# EAGLE board Xpander6-VIC (EAGLE 7.7.0)
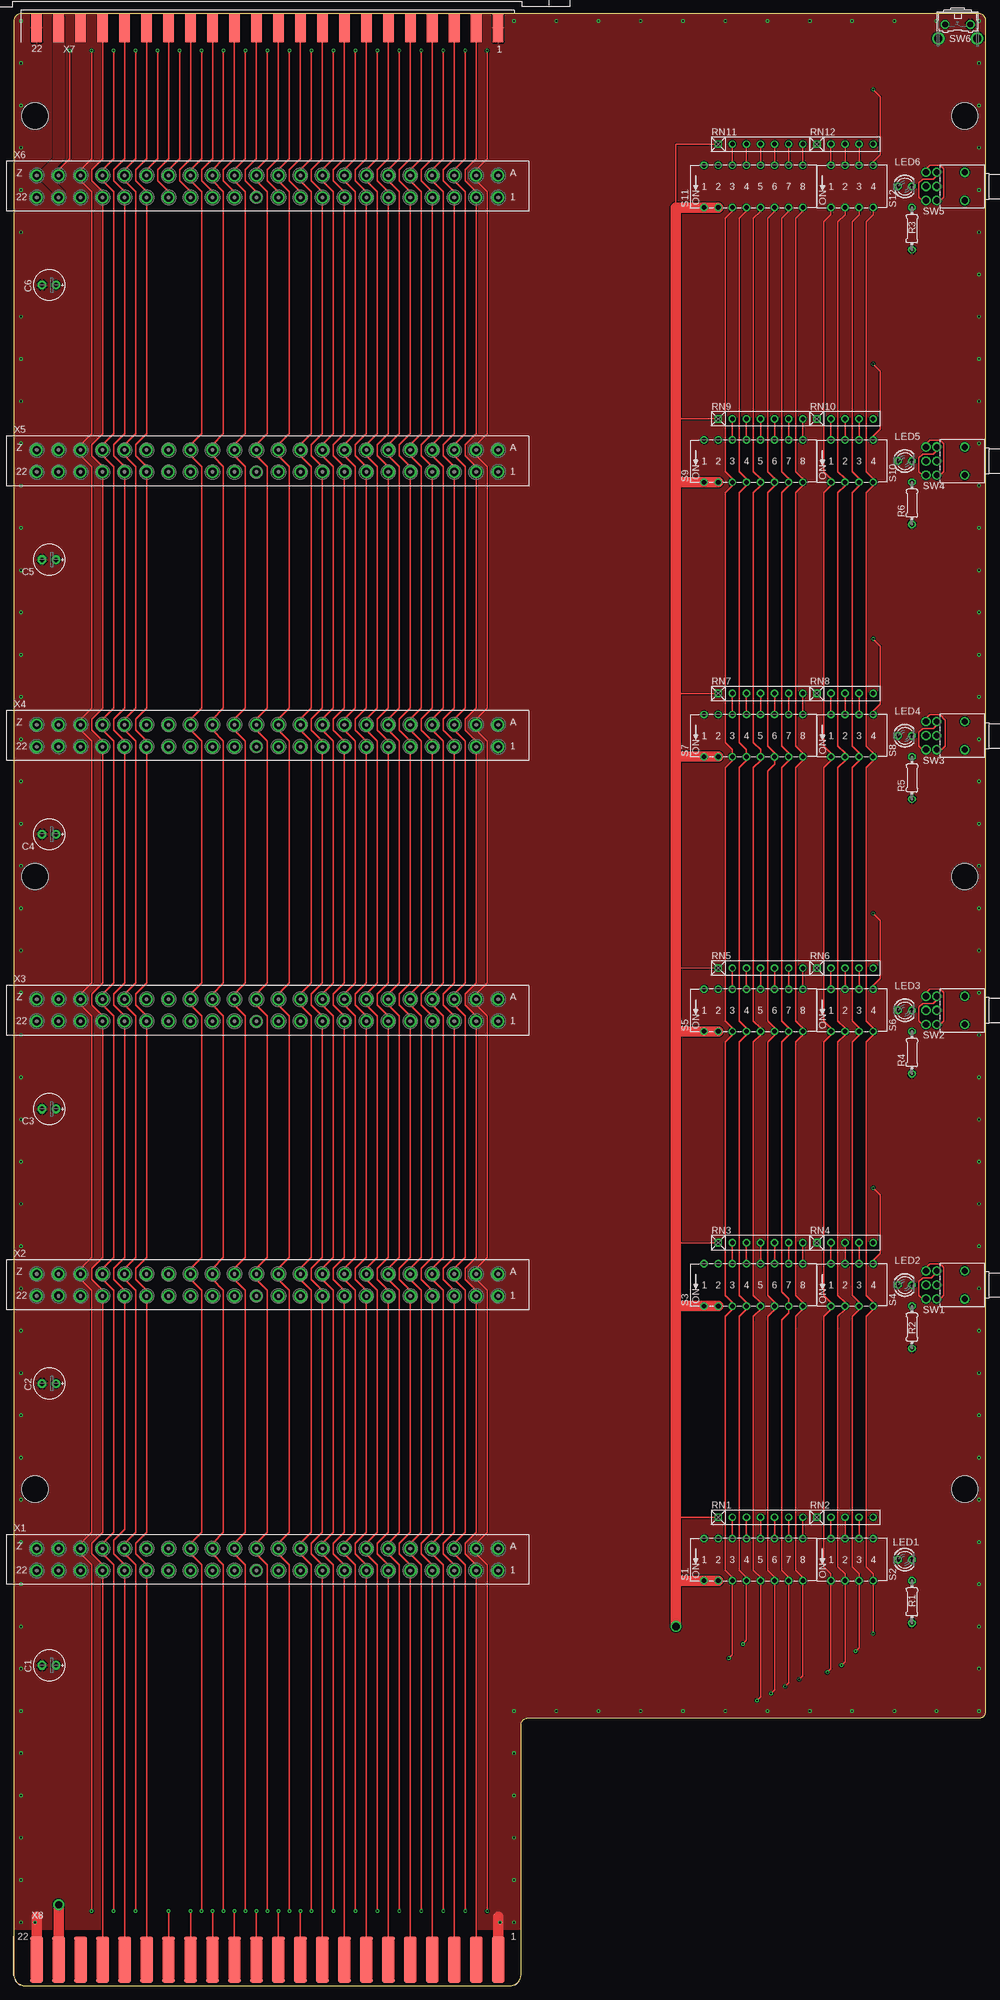
[diagram p5: board, top side]
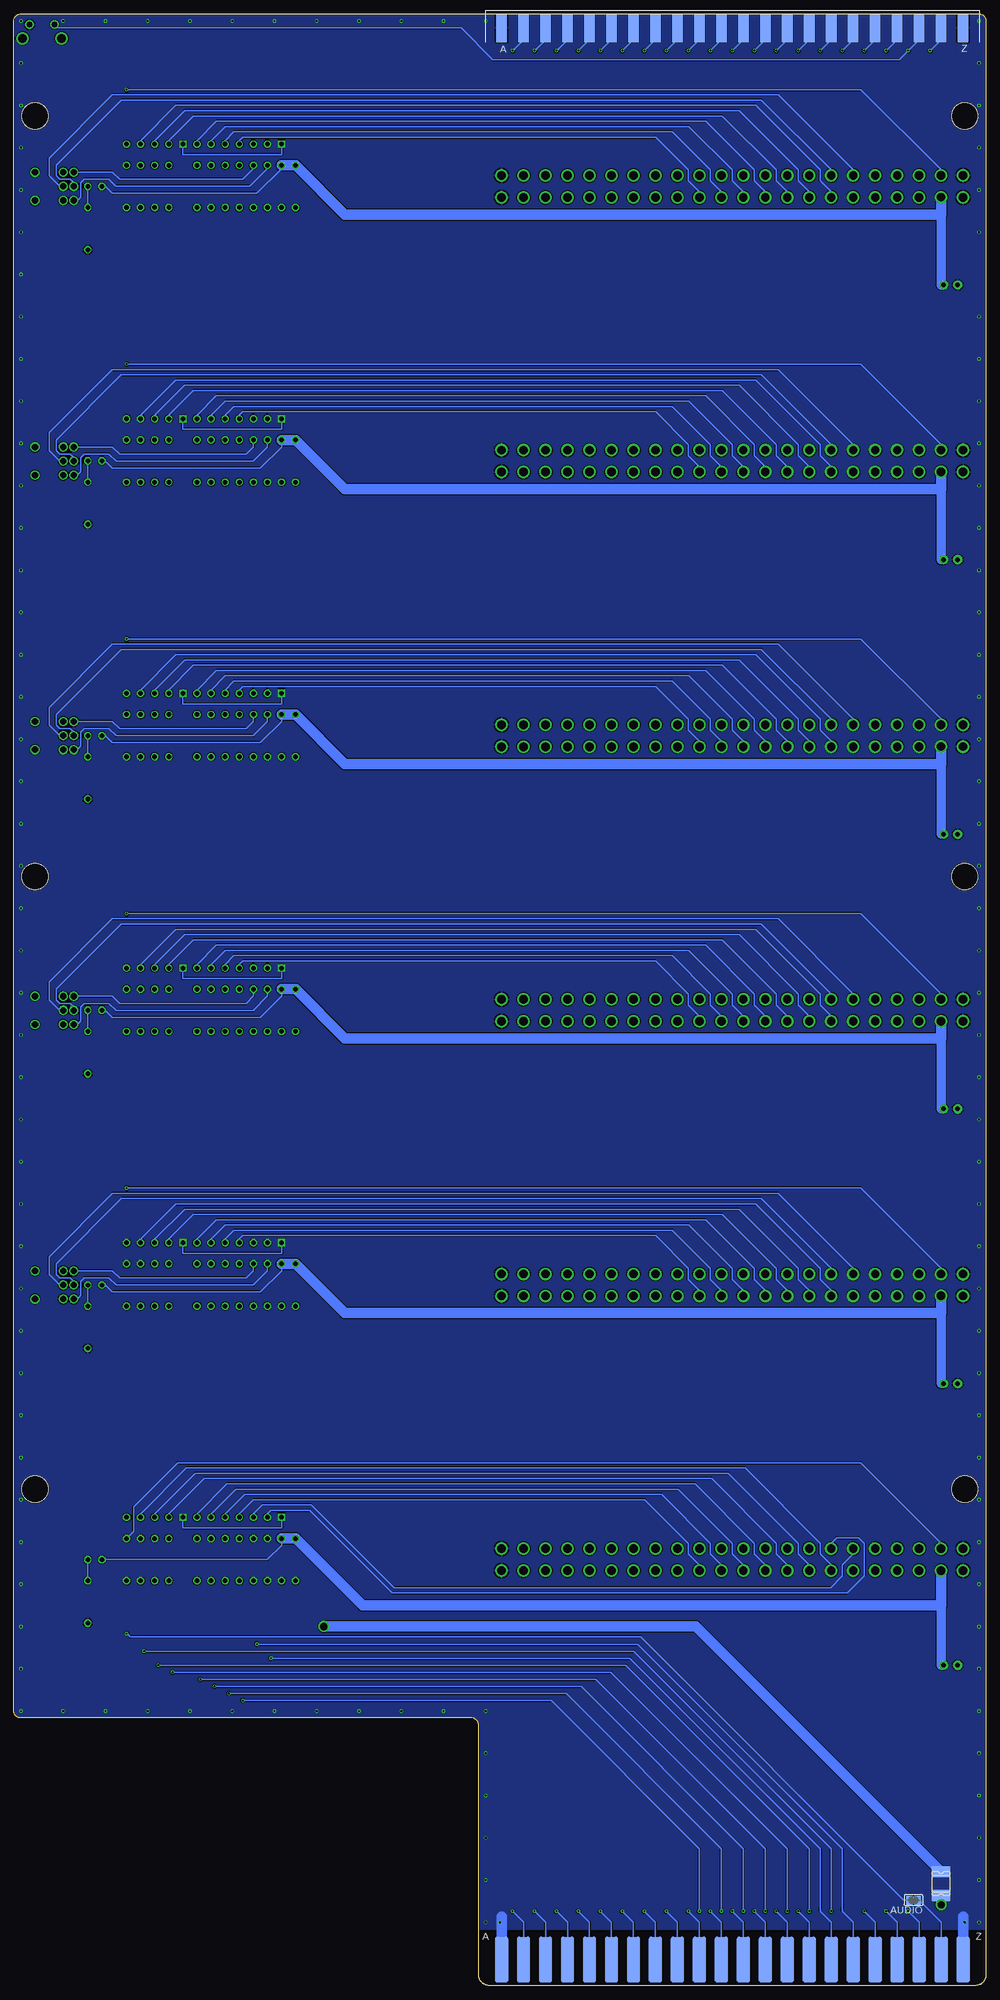
[diagram p6: board, bottom side, seen from below]

Size 175.26 x 355.6 mm. Coordinates in mm from the lower left corner, seen from the top.
Outline: 2,0 89.44,0 arc90 91.44,2 91.44,46.99 arc-90 92.71,48.26 173.99,48.26 arc90 175.26,49.53 175.26,354.33 arc90 173.99,355.6 1.27,355.6 arc90 0,354.33 0,2 arc90 2,0
Copper layers (1*16): Top 0.035mm / dielectric 1.5mm / Bottom 0.035mm
Design rules "hackvana *": minimum track width 6mil, minimum drill 0.3mm, track to track 6mil, track to pad 6mil, pad to pad 6mil, via to via 6mil, smd to smd 0mil, copper to edge 6mil, drill to drill 6mil, minimum pad ring 10mil, minimum via ring 6mil, stop-mask expansion 2mil, vias tented up to drill 100mil, thermal gap 10mil
Holes 4.75 mm at 171.45,89.53 171.45,337.19 3.81,337.19 3.81,89.53 3.81,200.02 171.45,200.02

## Footprints (pad centres in the part's own frame; a part is rotated, then mirrored left to right if it is on the bottom)
SJ = smd 1.168 x 1.6: 1 -0.762,0; 2 0.762,0
E2,5-6E = drill 0.813 pad 1.575: + -1.27,0 | drill 0.813 pad 1.575 octagon: - 1.27,0
1812L = smd 2.03 x 3.3: P$1 -2.16,0; P$2 2.16,0
LED3MM = drill 0.813 octagon: A -1.27,0; K 1.27,0
0204/7 = drill 0.813 octagon: 1 -3.81,0; 2 3.81,0
RN-7 = drill 0.813 square: 1 -7.62,0 | drill 0.813: 2 -5.08,0; 3 -2.54,0; 4 0,0; 5 2.54,0; 6 5.08,0; 7 7.62,0
RN-5 = drill 0.813 square: 1 -5.08,0 | drill 0.813: 2 -2.54,0; 3 0,0; 4 2.54,0; 5 5.08,0
DIP08SB = drill 0.813: 1 -8.89,-3.81; 2 -6.35,-3.81; 3 -3.81,-3.81; 4 -1.27,-3.81; 5 1.27,-3.81; 6 3.81,-3.81; 7 6.35,-3.81; 8 8.89,-3.81; 9 8.89,3.81; 10 6.35,3.81; 11 3.81,3.81; 12 1.27,3.81; 13 -1.27,3.81; 14 -3.81,3.81; 15 -6.35,3.81; 16 -8.89,3.81
DIP04SB = drill 0.813: 1 -3.81,-3.81; 2 -1.27,-3.81; 3 1.27,-3.81; 4 3.81,-3.81; 5 3.81,3.81; 6 1.27,3.81; 7 -1.27,3.81; 8 -3.81,3.81
TL4XWO = drill 1.1 pad 1.422: 1 -2.54,-5.08; 2 0,-5.08; 3 2.54,-5.08; 4 -2.54,-6.985; 5 0,-6.985; 6 2.54,-6.985 | drill 1.1 pad 1.676: M1 -2.54,0; M2 2.54,0
B3F-31XX = drill 1.016 octagon: 1 -2.261,-1.245; 2 2.261,-1.245 | drill 1.499 pad 2.159: 3 -3.505,1.245; 4 3.505,1.245
FE156-22-2 = drill 1.5: 1 41.605,-1.981; 2 37.643,-1.981; 3 33.68,-1.981; 4 29.718,-1.981; 5 25.756,-1.981; 6 21.793,-1.981; 7 17.831,-1.981; 8 13.868,-1.981; 9 9.906,-1.981; 10 5.944,-1.981; 11 1.981,-1.981; 12 -1.981,-1.981; 13 -5.944,-1.981; 14 -9.906,-1.981; 15 -13.868,-1.981; 16 -17.831,-1.981; 17 -21.793,-1.981; 18 -25.756,-1.981; 19 -29.718,-1.981; 20 -33.68,-1.981; 21 -37.644,-1.958; 22 -41.605,-1.98; A 41.605,1.981; B 37.643,1.981; C 33.68,1.981; D 29.718,1.981; E 25.756,1.981; F 21.793,1.981; H 17.831,1.981; J 13.868,1.981; K 9.906,1.981; L 5.944,1.981; M 1.981,1.981; N -1.981,1.981; P -5.944,1.981; R -9.906,1.981; S -13.868,1.981; T -17.831,1.981; U -21.793,1.981; V -25.756,1.981; W -29.718,1.981; X -33.68,1.981; Y -37.643,1.981; Z -41.605,1.981
MA156-22-2SHORT = smd 1.905 x 5.08: 1 41.605,0; 2 37.643,0; 3 33.68,0; 4 29.718,0; 5 25.756,0; 6 21.793,0; 7 17.831,0; 8 13.868,0; 9 9.906,0; 10 5.944,0; 11 1.981,0; 12 -1.981,0; 13 -5.944,0; 14 -9.906,0; 15 -13.868,0; 16 -17.831,0; 17 -21.793,0; 18 -25.756,0; 19 -29.718,0; 20 -33.68,0; 21 -37.643,0; 22 -41.605,0 | smd 1.905 x 5.08 bottom: A 41.605,0; B 37.643,0; C 33.68,0; D 29.718,0; E 25.756,0; F 21.793,0; H 17.831,0; J 13.868,0; K 9.906,0; L 5.944,0; M 1.981,0; N -1.981,0; P -5.944,0; R -9.906,0; S -13.868,0; T -17.831,0; U -21.793,0; V -25.756,0; W -29.718,0; X -33.68,0; Y -37.643,0; Z -41.605,0
MA156-22-2 = smd 2.286 x 8.255: 1 41.605,-0.381; 2 37.643,-0.381; 3 33.68,-0.381; 4 29.718,-0.381; 5 25.756,-0.381; 6 21.793,-0.381; 7 17.831,-0.381; 8 13.868,-0.381; 9 9.906,-0.381; 10 5.944,-0.381; 11 1.981,-0.381; 12 -1.981,-0.381; 13 -5.944,-0.381; 14 -9.906,-0.381; 15 -13.868,-0.381; 16 -17.831,-0.381; 17 -21.793,-0.381; 18 -25.756,-0.381; 19 -29.718,-0.381; 20 -33.68,-0.381; 21 -37.643,-0.381; 22 -41.605,-0.381 | smd 2.286 x 8.255 bottom: A 41.605,-0.381; B 37.643,-0.381; C 33.68,-0.381; D 29.718,-0.381; E 25.756,-0.381; F 21.793,-0.381; H 17.831,-0.381; J 13.868,-0.381; K 9.906,-0.381; L 5.944,-0.381; M 1.981,-0.381; N -1.981,-0.381; P -5.944,-0.381; R -9.906,-0.381; S -13.868,-0.381; T -17.831,-0.381; U -21.793,-0.381; V -25.756,-0.381; W -29.718,-0.381; X -33.68,-0.381; Y -37.643,-0.381; Z -41.605,-0.381

## Placement (x,y rotation side)
AUDIO  [SJ]  13.06,15.42 180 bottom
C1  47uF  [E2,5-6E]  6.35,57.78 180 top
C2  47uF  [E2,5-6E]  6.35,108.58 180 top
C3  47uF  [E2,5-6E]  6.35,158.12 180 top
C4  47uF  [E2,5-6E]  6.35,207.64 180 top
C5  47uF  [E2,5-6E]  6.35,257.18 180 top
C6  47uF  [E2,5-6E]  6.35,306.7 180 top
F1  1812L  [1812L]  8.08,18.39 90 bottom
LED1  [LED3MM]  160.66,76.83 0 top
LED2  [LED3MM]  160.66,126.36 0 top
LED3  [LED3MM]  160.66,175.89 0 top
LED4  [LED3MM]  160.66,225.43 0 top
LED5  [LED3MM]  160.66,274.95 0 top
LED6  [LED3MM]  160.66,324.49 0 top
R1  330  [0204/7]  161.93,69.21 90 top
R2  330  [0204/7]  161.93,118.74 90 top
R3  330  [0204/7]  161.93,316.87 90 top
R4  330  [0204/7]  161.93,168.27 90 top
R5  330  [0204/7]  161.93,217.81 90 top
R6  330  [0204/7]  161.93,267.33 90 top
RN1  [RN-7]  134.62,84.45 0 top
RN2  [RN-5]  149.86,84.45 0 top
RN3  [RN-7]  134.62,133.98 0 top
RN4  [RN-5]  149.86,133.98 0 top
RN5  [RN-7]  134.62,183.51 0 top
RN6  [RN-5]  149.86,183.51 0 top
RN7  [RN-7]  134.62,233.05 0 top
RN8  [RN-5]  149.86,233.05 0 top
RN9  [RN-7]  134.62,282.57 0 top
RN10  [RN-5]  149.86,282.57 0 top
RN11  [RN-7]  134.62,332.11 0 top
RN12  [RN-5]  149.86,332.11 0 top
S1  [DIP08SB]  133.35,76.83 0 top
S2  [DIP04SB]  151.13,76.83 0 top
S3  [DIP08SB]  133.35,126.36 0 top
S4  [DIP04SB]  151.13,126.36 0 top
S5  [DIP08SB]  133.35,175.89 0 top
S6  [DIP04SB]  151.13,175.89 0 top
S7  [DIP08SB]  133.35,225.43 0 top
S8  [DIP04SB]  151.13,225.43 0 top
S9  [DIP08SB]  133.35,274.95 0 top
S10  [DIP04SB]  151.13,274.95 0 top
S11  [DIP08SB]  133.35,324.49 0 top
S12  [DIP04SB]  151.13,324.49 0 top
SW1  TL46WO  [TL4XWO]  171.45,126.36 270 top
SW2  TL46WO  [TL4XWO]  171.45,175.89 270 top
SW3  TL46WO  [TL4XWO]  171.45,225.43 270 top
SW4  TL46WO  [TL4XWO]  171.45,274.95 270 top
SW5  TL46WO  [TL4XWO]  171.45,324.49 270 top
SW6  !RESET  [B3F-31XX]  170.18,352.42 180 top
X1  PORT_EXPANSION_VIC_CONN  [FE156-22-2]  45.72,76.83 0 top
X2  PORT_EXPANSION_VIC_CONN  [FE156-22-2]  45.72,126.36 0 top
X3  PORT_EXPANSION_VIC_CONN  [FE156-22-2]  45.72,175.89 0 top
X4  PORT_EXPANSION_VIC_CONN  [FE156-22-2]  45.72,225.43 0 top
X5  PORT_EXPANSION_VIC_CONN  [FE156-22-2]  45.72,274.95 0 top
X6  PORT_EXPANSION_VIC_CONN  [FE156-22-2]  45.72,324.49 0 top
X7  PORT_EXPANSION_VIC_CONNR  [MA156-22-2SHORT]  45.72,353.06 0 top
X8  PORT_EXPANSION_VIC_EDGE  [MA156-22-2]  45.72,5.08 0 top

## Tracks (layer width: path | path; a pad name or v marks a point on that pad's centre or on a via)
!BLK1  (via drill 0.3)
  Top 0.254: v133.99,51.43 134.62,52.07 S1.5 | 134.62,73.66 133.35,74.93 133.35,119.95 | X8.10 v51.66,13.44 | S9.5 134.62,271.78 133.35,273.05 133.35,318.77 134.62,320.04 S11.5 | 134.62,270.89 S9.5 | 133.35,119.95 133.35,120.65 134.62,121.92 S3.5 134.62,123.19 133.35,124.46 133.35,170.18 134.62,171.45 S5.5 134.62,172.72 133.35,173.99 133.35,219.71 134.62,220.98 S7.5 134.62,222.88 133.35,224.15 133.35,269.24 134.62,270.51 S9.5 | 133.35,119.95 | S11.5 | 134.62,73.66 | 134.62,73.66 S1.5 | S1.5
  Bottom 0.254: v133.99,51.43 78.38,51.43 51.66,24.71 v51.66,13.44
!BLK1_1
  Top 0.254: RN1.4 S1.12
  Bottom 0.254: X1.10 51.66,75.84 53.64,77.83 53.64,79.81 61.47,87.63 132.08,87.63 134.62,85.09 RN1.4
!BLK1_2
  Top 0.254: RN3.4 S3.12
  Bottom 0.254: X2.10 51.66,125.37 53.64,127.36 53.64,129.34 59.56,135.25 133.99,135.25 134.62,134.62 RN3.4
!BLK1_3
  Top 0.254: RN5.4 S5.12
  Bottom 0.254: X3.10 51.66,174.9 53.64,176.89 53.64,178.87 59.56,184.78 133.99,184.78 134.62,184.15 RN5.4
!BLK1_4
  Top 0.254: RN7.4 S7.12
  Bottom 0.254: X4.10 51.66,224.43 53.64,226.42 53.64,228.4 59.56,234.31 133.99,234.31 134.62,233.68 RN7.4
!BLK1_5
  Top 0.254: S9.12 | RN9.4 S9.12
  Bottom 0.254: X5.10 51.66,273.96 53.64,275.95 53.64,277.93 59.56,283.84 133.99,283.84 134.62,283.21 RN9.4
!BLK1_6
  Top 0.254: X6.10 51.66,323.49 49.68,325.48 49.68,327.46 51.66,329.44 X7.10 | RN11.4 S11.12
  Bottom 0.254: X6.10 51.66,323.49 53.64,325.48 53.64,327.46 59.56,333.38 133.99,333.38 134.62,332.74 | 134.62,332.74 | 134.62,332.74 | 134.62,332.74 RN11.4
!BLK2  (via drill 0.3)
  Top 0.254: v136.53,52.7 137.16,53.34 S1.6 | 137.16,73.66 135.89,74.93 135.89,118.74 | 135.89,118.74 135.89,119.95 | X8.11 v47.7,13.44 | S9.6 137.16,271.78 135.89,273.05 135.89,318.77 137.16,320.04 S11.6 | 137.16,270.89 S9.6 | 135.89,118.74 135.89,120.65 137.16,121.92 S3.6 137.16,123.19 135.89,124.46 135.89,170.18 137.16,171.45 S5.6 137.16,172.72 135.89,173.99 135.89,219.07 137.16,220.34 S7.6 137.16,222.25 135.89,223.52 135.89,269.24 137.16,270.51 S9.6 | 135.89,118.74 | S11.6 | 137.16,73.66 | 137.16,73.66 S1.6 | S1.6
  Bottom 0.254: v136.53,52.7 75.69,52.7 47.7,24.71 v47.7,13.44
!BLK2_1
  Top 0.254: RN1.5 S1.11
  Bottom 0.254: X1.11 47.7,75.84 49.68,77.83 49.68,79.81 58.46,88.58 133.67,88.58 137.16,85.09 RN1.5
!BLK2_2
  Top 0.254: RN3.5 S3.11
  Bottom 0.254: X2.11 47.7,125.37 49.68,127.36 49.68,129.34 56.55,136.21 135.57,136.21 137.16,134.62 RN3.5
!BLK2_3
  Top 0.254: RN5.5 S5.11
  Bottom 0.254: X3.11 47.7,174.9 49.68,176.89 49.68,178.87 56.55,185.74 135.57,185.74 137.16,184.15 RN5.5
!BLK2_4
  Top 0.254: RN7.5 S7.11
  Bottom 0.254: X4.11 47.7,224.43 49.68,226.42 49.68,228.4 56.55,235.27 135.57,235.27 137.16,233.68 RN7.5
!BLK2_5
  Top 0.254: RN9.5 S9.11
  Bottom 0.254: X5.11 47.7,273.96 49.68,275.95 49.68,277.93 56.55,284.8 135.57,284.8 137.16,283.21 RN9.5 137.16,282.32
!BLK2_6
  Top 0.254: X6.11 47.7,323.49 45.72,325.48 45.72,327.46 47.7,329.44 X7.11 | RN11.5 S11.11
  Bottom 0.254: X6.11 47.7,323.49 49.68,325.48 49.68,327.46 56.55,334.33 135.57,334.33 137.16,332.74 | 137.16,332.74 | 137.16,332.74 RN11.5
!BLK3  (via drill 0.3)
  Top 0.254: v139.06,53.97 139.7,54.61 S1.7 | 139.7,73.66 138.43,74.93 138.43,118.74 | 138.43,118.74 138.43,119.95 | X8.12 v43.74,13.44 | S9.7 139.7,271.78 138.43,273.05 138.43,318.77 139.7,320.04 S11.7 | 139.7,270.89 S9.7 | 138.43,118.74 138.43,120.01 139.7,121.28 S3.7 139.7,123.82 138.43,125.09 138.43,170.18 139.7,171.45 S5.7 139.7,172.72 138.43,173.99 138.43,219.71 139.7,220.98 S7.7 139.7,222.25 138.43,223.52 138.43,269.24 139.7,270.51 S9.7 | 138.43,118.74 | S11.7 | 139.7,73.66 | 139.7,73.66 S1.7 | S1.7
  Bottom 0.254: v139.06,53.97 73,53.97 43.74,24.71 v43.74,13.44
!BLK3_1
  Top 0.254: RN1.6 S1.10
  Bottom 0.254: X1.12 43.74,75.84 45.72,77.83 45.72,79.81 55.45,89.53 135.25,89.53 139.7,85.09 RN1.6
!BLK3_2
  Top 0.254: RN3.6 S3.10
  Bottom 0.254: X2.12 43.74,125.37 45.72,127.36 45.72,129.34 53.54,137.16 137.16,137.16 139.7,134.62 RN3.6
!BLK3_3
  Top 0.254: RN5.6 S5.10
  Bottom 0.254: X3.12 43.74,174.9 45.72,176.89 45.72,178.87 53.54,186.69 137.16,186.69 139.7,184.15 RN5.6
!BLK3_4
  Top 0.254: RN7.6 S7.10
  Bottom 0.254: X4.12 43.74,224.43 45.72,226.42 45.72,228.4 53.54,236.22 137.16,236.22 139.7,233.68 RN7.6
!BLK3_5
  Top 0.254: RN9.6 S9.10
  Bottom 0.254: X5.12 43.74,273.96 45.72,275.95 45.72,277.93 53.54,285.75 137.16,285.75 139.7,283.21 RN9.6 139.7,282.32
!BLK3_6
  Top 0.254: X6.12 43.74,323.49 41.76,325.48 41.76,327.46 43.74,329.44 X7.12 | RN11.6 S11.10
  Bottom 0.254: X6.12 43.74,323.49 45.72,325.48 45.72,327.46 53.54,335.28 137.16,335.28 139.7,332.74 | 139.7,332.74 | 139.7,332.74 RN11.6
!BLK5  (via drill 0.3)
  Top 0.254: v141.61,55.24 142.24,55.88 S1.8 | 142.24,73.66 140.97,74.93 140.97,118.74 | 140.97,118.74 140.97,119.95 | X8.13 v39.78,13.44 | S9.8 142.24,271.78 140.97,273.05 140.97,318.77 142.24,320.04 S11.8 | 142.24,270.89 S9.8 | 140.97,118.74 140.97,120.65 142.24,121.92 S3.8 142.24,123.19 140.97,124.46 140.97,170.18 142.24,171.45 S5.8 142.24,172.72 140.97,173.99 140.97,219.71 142.24,220.98 S7.8 142.24,222.25 140.97,223.52 140.97,269.24 142.24,270.51 S9.8 | 140.97,118.74 | S11.8 | 142.24,73.66 | 142.24,73.66 S1.8 | S1.8
  Bottom 0.254: v141.61,55.24 70.31,55.24 39.78,24.71 v39.78,13.44
!BLK5_1
  Top 0.254: RN1.7 S1.9
  Bottom 0.254: X1.13 39.78,75.84 41.76,77.83 41.76,79.81 52.44,90.49 136.84,90.49 142.24,85.09 RN1.7
!BLK5_2
  Top 0.254: RN3.7 S3.9
  Bottom 0.254: X2.13 39.78,125.37 41.76,127.36 41.76,129.34 50.53,138.11 138.75,138.11 142.24,134.62 RN3.7
!BLK5_3
  Top 0.254: RN5.7 S5.9
  Bottom 0.254: X3.13 39.78,174.9 41.76,176.89 41.76,178.87 50.53,187.64 138.75,187.64 142.24,184.15 RN5.7
!BLK5_4
  Top 0.254: RN7.7 S7.9
  Bottom 0.254: X4.13 39.78,224.43 41.76,226.42 41.76,228.4 50.53,237.17 138.75,237.17 142.24,233.68 RN7.7
!BLK5_5
  Top 0.254: RN9.7 S9.9
  Bottom 0.254: X5.13 39.78,273.96 41.76,275.95 41.76,277.93 50.53,286.7 138.75,286.7 142.24,283.21 RN9.7 142.24,282.32
!BLK5_6
  Top 0.254: X6.13 39.78,323.49 37.8,325.48 37.8,327.46 39.78,329.44 X7.13 | RN11.7 S11.9
  Bottom 0.254: X6.13 39.78,323.49 41.76,325.48 41.76,327.46 50.53,336.23 138.75,336.23 142.24,332.74 | 142.24,332.74 | 142.24,332.74 RN11.7
!IO2  (via drill 0.3)
  Top 0.254: v128.91,59.05 129.54,59.69 S1.3 | 128.27,119.95 128.27,74.93 129.54,73.66 S1.3 | S9.3 129.54,271.78 128.27,273.05 128.27,318.77 129.54,320.04 S11.3 | 129.54,270.89 S9.3 | 128.27,119.95 128.27,120.65 129.54,121.92 S3.3 129.54,123.19 128.27,124.46 128.27,170.18 129.54,171.45 S5.3 129.54,172.72 128.27,173.99 128.27,219.71 129.54,220.98 S7.3 129.54,222.88 128.27,224.15 128.27,269.24 129.54,270.51 S9.3 | 128.27,119.95 | S11.3 | S1.3
  Bottom 0.254: v128.91,59.05 64.21,59.05 29.87,24.71 29.87,13.97 29.87,13.44 27.89,11.45 X8.T
!IO2_1
  Top 0.254: RN1.2 S1.14
  Bottom 0.254: X1.T 27.89,79.81 26.9,80.8 22.94,80.8 21.95,79.81 21.95,73.86 25.01,70.8 107,70.8 121.92,85.72 128.91,85.72 129.54,85.09 RN1.2
!IO2_2
  Bottom 0.254: X2.T 27.89,129.34 40.48,141.92 155.89,141.92 167.64,130.18 167.64,128.27 167,127.63 165.1,127.63 164.47,127 SW1.5
!IO2_3
  Bottom 0.254: X3.T 27.89,178.87 40.48,191.45 155.89,191.45 167.64,179.7 167.64,177.8 167,177.16 165.1,177.16 164.47,176.53 SW2.5
!IO2_4
  Bottom 0.254: X4.T 27.89,228.4 40.48,240.98 155.89,240.98 167.64,229.24 167.64,227.33 167,226.69 165.1,226.69 164.47,226.06 SW3.5
!IO2_5
  Bottom 0.254: SW4.5 164.47,275.59 165.1,276.22 167,276.22 167.64,276.86 167.64,278.76 155.89,290.51 40.48,290.51 27.89,277.93 X5.T
!IO2_6  (via drill 0.3)
  Top 0.254: 29.87,329.44 | X6.T 27.89,327.46 29.87,329.44 | v29.87,348.97 29.87,329.44
  Bottom 0.254: X6.T 27.89,327.46 40.48,340.04 155.89,340.04 167.64,328.3 167.64,326.39 167,325.75 165.1,325.75 164.47,325.12 SW5.5 | v29.87,348.97 27.89,350.95 X7.T
!IO2SW_2
  Top 0.254: RN3.2 S3.14 | SW1.1 166.37,128.27 166.05,128.27 165.42,127.63 163.83,127.63 163.19,127 163.19,124.46 163.83,123.82 SW1.6
  Bottom 0.254: S3.14 129.54,128.91 132.08,126.36 156.84,126.36 158.12,127.63 162.56,127.63 163.19,127 163.19,124.46 163.83,123.82 SW1.6
!IO2SW_3
  Top 0.254: RN5.2 S5.14 | SW2.1 166.37,177.8 165.74,177.16 163.83,177.16 163.19,176.53 163.19,173.99 163.83,173.35 SW2.6
  Bottom 0.254: SW2.6 163.83,173.35 163.19,173.99 163.19,176.53 162.56,177.16 158.12,177.16 156.84,175.89 132.08,175.89 129.54,178.44 S5.14
!IO2SW_4
  Top 0.254: RN7.2 S7.14 | SW3.1 166.37,227.33 165.74,226.69 163.83,226.69 163.19,226.06 163.19,223.52 163.67,223.04 164.31,223.04 SW3.6
  Bottom 0.254: S7.14 129.54,227.96 132.08,225.43 156.84,225.43 158.12,226.69 162.56,226.69 163.19,226.06 163.19,223.52 163.83,222.88 SW3.6
!IO2SW_5
  Top 0.254: SW4.1 166.37,276.86 165.74,276.22 163.83,276.22 163.19,275.59 163.19,273.05 163.83,272.42 SW4.6 | RN9.2 S9.14
  Bottom 0.254: SW4.6 163.83,272.42 163.19,273.05 163.19,275.59 162.56,276.22 158.12,276.22 156.84,274.95 132.08,274.95 129.54,277.5 S9.14
!IO2SW_6
  Top 0.254: SW5.1 166.37,326.39 165.74,325.75 163.83,325.75 163.19,325.12 163.19,322.58 163.83,321.94 SW5.6 | RN11.2 S11.14
  Bottom 0.254: SW5.6 163.83,321.94 163.19,322.58 163.19,325.12 162.56,325.75 158.12,325.75 156.84,324.49 132.72,324.49 129.54,327.66 S11.14
!IO3  (via drill 0.3)
  Top 0.254: v131.44,61.59 132.08,62.23 S1.4 | 130.81,119.95 130.81,74.93 132.08,73.66 | S9.4 132.08,271.78 130.81,273.05 130.81,318.77 132.08,320.04 S11.4 | 132.08,270.89 S9.4 | 130.81,119.95 130.81,120.65 132.08,121.92 S3.4 132.08,123.19 130.81,124.46 130.81,170.18 132.08,171.45 S5.4 132.08,172.72 130.81,173.99 130.81,219.71 132.08,220.98 S7.4 132.08,222.88 130.81,224.15 130.81,269.24 132.08,270.51 S9.4 | 130.81,119.95 | S11.4 | 132.08,73.66 | 132.08,73.66 S1.4 | S1.4
  Bottom 0.254: 25.91,13.97 25.91,24.71 62.79,61.59 v131.44,61.59 | X8.U 23.93,11.45 25.91,13.44 25.91,13.97 | 25.91,13.97
!IO3_1
  Top 0.254: RN1.3 S1.13
  Bottom 0.254: X1.U 23.93,77.83 25.91,75.84 25.91,73.86 28.02,71.75 106.68,71.75 121.6,86.68 130.49,86.68 132.08,85.09 RN1.3
!IO3_2
  Bottom 0.254: X2.U 23.93,129.34 37.46,142.88 157.48,142.88 168.91,131.44 168.91,128.27 167,126.36 SW1.2
!IO3_3
  Bottom 0.254: X3.U 23.93,178.87 37.46,192.4 157.48,192.4 168.91,180.97 168.91,177.8 167,175.89 SW2.2
!IO3_4
  Bottom 0.254: X4.U 23.93,228.4 37.46,241.94 157.48,241.94 168.91,230.5 168.91,227.33 167,225.43 SW3.2
!IO3_5
  Bottom 0.254: SW4.2 167,274.95 168.91,276.86 168.91,280.03 157.48,291.46 37.46,291.46 23.93,277.93 X5.U
!IO3_6  (via drill 0.3)
  Top 0.254: 25.91,329.44 | X6.U 23.93,327.46 25.91,329.44 | v25.91,348.97 25.91,329.44
  Bottom 0.254: X6.U 23.93,327.46 37.46,341 157.48,341 168.91,329.56 168.91,326.39 167,324.49 SW5.2 | v25.91,348.97 23.93,350.95 X7.U
!IO3SW_2
  Top 0.254: RN3.3 S3.13 | SW1.3 167,123.82 167.64,124.46 167.64,129.54 167,130.18 165.1,130.18 164.47,129.54 SW1.4
  Bottom 0.254: S3.13 132.08,128.91 133.35,127.63 156.21,127.63 157.48,128.91 SW1.4
!IO3SW_3
  Top 0.254: RN5.3 S5.13 | SW2.4 164.47,179.07 165.1,179.7 167,179.7 167.64,179.07 167.64,173.99 167,173.35 SW2.3
  Bottom 0.254: SW2.4 157.48,178.44 156.21,177.16 133.35,177.16 132.08,178.44 S5.13
!IO3SW_4
  Top 0.254: RN7.3 S7.13 | SW3.4 164.47,228.6 165.1,229.24 167,229.24 167.96,228.28 167.96,223.52 167.32,222.88 SW3.3
  Bottom 0.254: S7.13 132.08,227.96 133.35,226.69 156.21,226.69 157.48,227.96 SW3.4
!IO3SW_5
  Top 0.254: S9.13 | SW4.4 164.47,278.13 165.1,278.76 167,278.76 167.64,278.13 167.64,273.05 167,272.42 SW4.3 | RN9.3 S9.13
  Bottom 0.254: SW4.4 157.48,277.5 156.21,276.22 133.35,276.22 132.08,277.5 S9.13
!IO3SW_6
  Top 0.254: SW5.4 164.47,327.66 165.1,328.3 167,328.3 167.64,327.66 167.64,322.58 167,321.94 SW5.3 | RN11.3 S11.13
  Bottom 0.254: SW5.4 157.48,327.02 156.21,325.75 133.99,325.75 132.08,327.66 S11.13
!IRQ
  Top 0.254: X8.19 | X8.19 X1.19 16,75.84 14.02,77.83 14.02,79.81 16,81.79 X2.19 16,125.37 14.02,127.36 14.02,129.34 16,131.32 X3.19 16,174.9 14.02,176.89 14.02,178.87 16,180.85 X4.19 16,224.43 14.02,226.42 14.02,228.4 16,230.38 X5.19 16,273.96 14.02,275.95 14.02,277.93 16,279.91 X6.19 16,323.49 14.02,325.48 14.02,327.46 16,329.44 X7.19
!NMI  (via drill 0.3)
  Top 0.254: 17.98,329.44 | v17.98,13.44 17.98,75.84 16,77.83 X1.W 16,79.81 17.98,81.79 17.98,125.37 16,127.36 X2.W 16,129.34 17.98,131.32 | v17.98,348.97 17.98,329.44 | 17.98,329.44 16,327.46 X6.W 16,325.48 17.98,323.49 17.98,279.91 16,277.93 X5.W 16,275.95 17.98,273.96 17.98,230.38 16,228.4 X4.W 16,226.42 17.98,224.43 17.98,180.85 16,178.87 X3.W 16,176.89 17.98,174.9 17.98,131.32 | 17.98,131.32
  Bottom 0.254: v17.98,13.44 16,11.45 X8.W | v17.98,348.97 16,350.95 X7.W
!RAM1  (via drill 0.3)
  Top 0.254: v146.69,56.51 147.32,57.15 S2.1 | 147.32,74.29 146.05,75.56 146.05,118.74 | 146.05,118.74 146.05,119.95 | X8.14 v35.81,13.44 | S10.1 147.32,271.78 146.05,273.05 146.05,318.13 147.32,319.4 S12.1 | 147.32,270.89 S10.1 | 146.05,118.74 146.05,120.65 147.32,121.92 S4.1 147.32,123.19 146.05,124.46 146.05,170.18 147.32,171.45 S6.1 147.32,172.72 146.05,173.99 146.05,219.71 147.32,220.98 S8.1 147.32,222.25 146.05,223.52 146.05,269.24 147.32,270.51 S10.1 | 146.05,118.74 | S12.1 | 147.32,74.29 | 147.32,74.29 S2.1 | S2.1
  Bottom 0.254: v146.69,56.51 67.61,56.51 35.81,24.71 v35.81,13.44
!RAM1_1
  Top 0.254: RN2.2 S2.8
  Bottom 0.254: X1.14 35.81,75.84 37.8,77.83 37.8,79.81 49.43,91.44 140.97,91.44 147.32,85.09 RN2.2
!RAM1_2
  Top 0.254: RN4.2 S4.8
  Bottom 0.254: X2.14 35.81,125.37 37.8,127.36 37.8,129.34 47.52,139.06 142.88,139.06 147.32,134.62 RN4.2
!RAM1_3
  Top 0.254: RN6.2 S6.8
  Bottom 0.254: X3.14 35.81,174.9 37.8,176.89 37.8,178.87 47.52,188.59 142.88,188.59 147.32,184.15 RN6.2
!RAM1_4
  Top 0.254: RN8.2 S8.8
  Bottom 0.254: X4.14 35.81,224.43 37.8,226.42 37.8,228.4 47.52,238.12 142.88,238.12 147.32,233.68 RN8.2
!RAM1_5
  Top 0.254: RN10.2 S10.8
  Bottom 0.254: X5.14 35.81,273.96 37.8,275.95 37.8,277.93 47.52,287.65 142.88,287.65 147.32,283.21 RN10.2 147.32,282.32
!RAM1_6
  Top 0.254: X6.14 35.81,323.49 33.83,325.48 33.83,327.46 35.81,329.44 X7.14 | RN12.2 S12.8
  Bottom 0.254: X6.14 35.81,323.49 37.8,325.48 37.8,327.46 47.52,337.19 142.88,337.19 147.32,332.74 | 147.32,332.74 | 147.32,332.74 RN12.2
!RAM2  (via drill 0.3)
  Top 0.254: v149.22,57.78 149.86,58.42 S2.2 | 149.86,74.29 148.59,75.56 148.59,118.74 | 148.59,118.74 148.59,119.95 | X8.15 v31.85,13.44 | S10.2 149.86,271.78 148.59,273.05 148.59,318.13 149.86,319.4 S12.2 | 149.86,270.89 S10.2 | 148.59,118.74 148.59,120.65 149.86,121.92 S4.2 149.86,123.19 148.59,124.46 148.59,170.18 149.86,171.45 S6.2 149.86,172.72 148.59,173.99 148.59,219.71 149.86,220.98 S8.2 149.86,222.25 148.59,223.52 148.59,269.24 149.86,270.51 S10.2 | 148.59,118.74 | S12.2 | 149.86,74.29 | 149.86,74.29 S2.2 | S2.2
  Bottom 0.254: v149.22,57.78 64.92,57.78 31.85,24.71 v31.85,13.44
!RAM2_1
  Top 0.254: RN2.3 S2.7
  Bottom 0.254: X1.15 31.85,75.84 33.83,77.83 33.83,79.81 46.42,92.39 142.56,92.39 149.86,85.09 RN2.3
!RAM2_2
  Top 0.254: RN4.3 S4.7
  Bottom 0.254: X2.15 31.85,125.37 33.83,127.36 33.83,129.34 44.51,140.02 144.46,140.02 149.86,134.62 RN4.3
!RAM2_3
  Top 0.254: RN6.3 S6.7
  Bottom 0.254: X3.15 31.85,174.9 33.83,176.89 33.83,178.87 44.51,189.55 144.46,189.55 149.86,184.15 RN6.3
!RAM2_4
  Top 0.254: RN8.3 S8.7
  Bottom 0.254: X4.15 31.85,224.43 33.83,226.42 33.83,228.4 44.51,239.08 144.46,239.08 149.86,233.68 RN8.3
!RAM2_5
  Top 0.254: RN10.3 | RN10.3 | RN10.3 S10.7
  Bottom 0.254: X5.15 31.85,273.96 33.83,275.95 33.83,277.93 44.51,288.61 144.46,288.61 149.86,283.21 RN10.3
!RAM2_6
  Top 0.254: X6.15 31.85,323.49 29.87,325.48 29.87,327.46 31.85,329.44 X7.15 | RN12.3 S12.7
  Bottom 0.254: X6.15 31.85,323.49 33.83,325.48 33.83,327.46 44.51,338.14 144.46,338.14 149.86,332.74 | 149.86,332.74 | 149.86,332.74 RN12.3
!RAM3  (via drill 0.3)
  Top 0.254: v151.76,60.32 152.4,60.96 S2.3 | 152.4,74.29 151.13,75.56 151.13,118.74 | 151.13,118.74 151.13,119.95 | 151.13,126.36 151.13,170.18 152.4,171.45 S6.3 152.4,172.72 151.13,173.99 151.13,219.71 152.4,220.98 S8.3 152.4,222.25 151.13,223.52 151.13,269.24 152.4,270.51 S10.3 152.4,271.78 151.13,273.05 151.13,318.13 152.4,319.4 S12.3 | X8.16 v27.89,13.44 | 151.13,118.74 151.13,120.65 152.4,121.92 S4.3 152.4,123.19 151.13,124.46 151.13,126.36 | 151.13,118.74 | 151.13,126.36 | S12.3 | 152.4,74.29 | 152.4,74.29 S2.3 | S2.3
  Bottom 0.254: v151.76,60.32 63.5,60.32 27.89,24.71 v27.89,13.44
!RAM3_1
  Top 0.254: RN2.4 S2.6
  Bottom 0.254: X1.16 27.89,75.84 29.87,77.83 29.87,79.81 43.41,93.34 144.14,93.34 152.4,85.09 RN2.4
!RAM3_2
  Top 0.254: RN4.4 S4.6
  Bottom 0.254: X2.16 27.89,125.37 29.87,127.36 29.87,129.34 41.5,140.97 146.05,140.97 152.4,134.62 RN4.4
!RAM3_3
  Top 0.254: RN6.4 S6.6
  Bottom 0.254: X3.16 27.89,174.9 29.87,176.89 29.87,178.87 41.5,190.5 146.05,190.5 152.4,184.15 RN6.4
!RAM3_4
  Top 0.254: RN8.4 S8.6
  Bottom 0.254: X4.16 27.89,224.43 29.87,226.42 29.87,228.4 41.5,240.03 146.05,240.03 152.4,233.68 RN8.4
!RAM3_5
  Top 0.254: RN10.4 S10.6
  Bottom 0.254: X5.16 27.89,273.96 29.87,275.95 29.87,277.93 41.5,289.56 146.05,289.56 152.4,283.21 RN10.4 152.4,282.32
!RAM3_6
  Top 0.254: X6.16 27.89,323.49 25.91,325.48 25.91,327.46 27.89,329.44 X7.16 | RN12.4 S12.6
  Bottom 0.254: X6.16 27.89,323.49 29.87,325.48 29.87,327.46 41.5,339.09 146.05,339.09 152.4,332.74 | 152.4,332.74 | 152.4,332.74 RN12.4
!RESET  (via drill 0.3)
  Top 0.254: 14.02,329.44 | 14.02,329.44 12.04,327.46 X6.X 12.04,325.48 14.02,323.49 14.02,279.91 12.04,277.93 X5.X 12.04,275.95 14.02,273.96 14.02,230.38 12.04,228.4 X4.X 12.04,226.42 14.02,224.43 14.02,180.85 12.04,178.87 X3.X 12.04,176.89 14.02,174.9 14.02,131.32 12.04,129.34 X2.X 12.04,127.36 14.02,125.37 14.02,81.79 12.04,79.81 X1.X 12.04,77.83 14.02,75.84 14.02,75.35 | 14.02,75.35 | 14.02,75.35 v14.02,13.44 | v14.02,13.44 | v14.02,348.97 14.02,329.44
  Bottom 0.254: v14.02,13.44 12.04,11.45 X8.X | SW6.2 167.31,353.06 94.62,353.06 88.9,347.34 15.65,347.34 v14.02,348.97 12.04,350.95 X7.X
A0  (via drill 0.3)
  Top 0.254: 85.34,329.44 | 85.34,81.79 | v85.34,13.44 85.34,75.84 83.36,77.83 X1.B 83.36,79.81 85.34,81.79 | v85.34,348.97 85.34,329.44 | 85.34,329.44 83.36,327.46 X6.B 83.36,325.48 85.34,323.49 85.34,279.91 83.36,277.93 X5.B 83.36,275.95 85.34,273.96 85.34,230.38 83.36,228.4 X4.B 83.36,226.42 85.34,224.43 85.34,180.85 83.36,178.87 X3.B 83.36,176.89 85.34,174.9 85.34,131.32 83.36,129.34 X2.B 83.36,127.36 85.34,125.37 85.34,81.79
  Bottom 0.254: v85.34,13.44 83.36,11.45 X8.B | v85.34,348.97 83.36,350.95 X7.B
A1  (via drill 0.3)
  Top 0.254: 81.38,329.44 | 81.38,329.44 79.4,327.46 X6.C 79.4,325.48 81.38,323.49 81.38,279.91 79.4,277.93 X5.C 79.4,275.95 81.38,273.96 81.38,230.38 79.4,228.4 X4.C 79.4,226.42 81.38,224.43 81.38,180.85 79.4,178.87 X3.C 79.4,176.89 81.38,174.9 81.38,131.32 79.4,129.34 X2.C 79.4,127.36 81.38,125.37 81.38,81.79 | 81.38,81.79 | v81.38,13.44 81.38,75.84 79.4,77.83 X1.C 79.4,79.81 81.38,81.79 | v81.38,348.97 81.38,329.44
  Bottom 0.254: 79.4,4.52 X8.C 79.4,11.45 v81.38,13.44 | v81.38,348.97 79.4,350.95 X7.C
A2  (via drill 0.3)
  Top 0.254: 77.42,329.44 | 77.42,81.79 | v77.42,13.44 77.42,75.84 75.44,77.83 X1.D 75.44,79.81 77.42,81.79 | v77.42,348.97 77.42,329.44 | 77.42,329.44 75.44,327.46 X6.D 75.44,325.48 77.42,323.49 77.42,279.91 75.44,277.93 X5.D 75.44,275.95 77.42,273.96 77.42,230.38 75.44,228.4 X4.D 75.44,226.42 77.42,224.43 77.42,180.85 75.44,178.87 X3.D 75.44,176.89 77.42,174.9 77.42,131.32 75.44,129.34 X2.D 75.44,127.36 77.42,125.37 77.42,81.79
  Bottom 0.254: v77.42,13.44 75.44,11.45 X8.D | v77.42,348.97 75.44,350.95 X7.D
A3  (via drill 0.3)
  Top 0.254: 73.46,329.44 | 73.46,329.44 71.48,327.46 X6.E 71.48,325.48 73.46,323.49 73.46,279.91 71.48,277.93 X5.E 71.48,275.95 73.46,273.96 73.46,230.38 71.48,228.4 X4.E 71.48,226.42 73.46,224.43 73.46,180.85 71.48,178.87 X3.E 71.48,176.89 73.46,174.9 73.46,131.32 71.48,129.34 X2.E 71.48,127.36 73.46,125.37 73.46,81.79 | 73.46,81.79 | v73.46,13.44 73.46,75.84 71.48,77.83 X1.E 71.48,79.81 73.46,81.79 | v73.46,348.97 73.46,329.44
  Bottom 0.254: v73.46,13.44 71.48,11.45 X8.E | v73.46,348.97 71.48,350.95 X7.E
A4  (via drill 0.3)
  Top 0.254: 69.5,329.44 69.49,329.44 | 69.49,329.44 67.51,327.46 X6.F 67.51,325.48 69.49,323.49 69.49,279.91 67.51,277.93 X5.F 67.51,275.95 69.49,273.96 69.49,230.38 67.51,228.4 X4.F 67.51,226.42 69.49,224.43 69.49,180.85 67.51,178.87 X3.F 67.51,176.89 69.49,174.9 69.49,131.32 67.51,129.34 X2.F 67.51,127.36 69.49,125.37 69.49,81.79 | 69.5,81.79 69.49,81.79 | v69.49,13.44 69.49,75.84 67.51,77.83 X1.F 67.51,79.81 69.49,81.79 | v69.49,348.97 69.49,329.44
  Bottom 0.254: v69.49,13.44 67.51,11.45 X8.F | v69.49,348.97 67.51,350.95 X7.F
A5  (via drill 0.3)
  Top 0.254: 65.53,329.44 | 65.53,81.79 | 65.53,75.84 63.55,77.83 X1.H 63.55,79.81 65.53,81.79 | 65.53,75.84 | 65.53,75.84 v65.53,13.44 | v65.53,348.97 65.53,329.44 | 65.53,329.44 63.55,327.46 X6.H 63.55,325.48 65.53,323.49 65.53,279.91 63.55,277.93 X5.H 63.55,275.95 65.53,273.96 65.53,230.38 63.55,228.4 X4.H 63.55,226.42 65.53,224.43 65.53,180.85 63.55,178.87 X3.H 63.55,176.89 65.53,174.9 65.53,131.32 63.55,129.34 X2.H 63.55,127.36 65.53,125.37 65.53,81.79
  Bottom 0.254: v65.53,13.44 63.55,11.45 X8.H | v65.53,348.97 63.55,350.95 X7.H
A6  (via drill 0.3)
  Top 0.254: 61.57,329.44 | 61.57,81.79 | 61.57,75.84 59.59,77.83 X1.J 59.59,79.81 61.57,81.79 | 61.57,75.84 | 61.57,75.84 v61.57,13.44 | v61.57,348.97 61.57,329.44 | 61.57,329.44 59.59,327.46 X6.J 59.59,325.48 61.57,323.49 61.57,279.91 59.59,277.93 X5.J 59.59,275.95 61.57,273.96 61.57,230.38 59.59,228.4 X4.J 59.59,226.42 61.57,224.43 61.57,180.85 59.59,178.87 X3.J 59.59,176.89 61.57,174.9 61.57,131.32 59.59,129.34 X2.J 59.59,127.36 61.57,125.37 61.57,81.79
  Bottom 0.254: v61.57,13.44 59.59,11.45 X8.J | v61.57,348.97 59.59,350.95 X7.J
A7  (via drill 0.3)
  Top 0.254: 57.61,329.44 | 57.61,81.79 | 57.61,81.79 55.63,79.81 X1.K 55.63,77.83 57.61,75.84 v57.61,13.44 | v57.61,348.97 57.61,329.44 | 57.61,329.44 55.63,327.46 X6.K 55.63,325.48 57.61,323.49 57.61,279.91 55.63,277.93 X5.K 55.63,275.95 57.61,273.96 57.61,230.38 55.63,228.4 X4.K 55.63,226.42 57.61,224.43 57.61,180.85 55.63,178.87 X3.K 55.63,176.89 57.61,174.9 57.61,131.32 55.63,129.34 X2.K 55.63,127.36 57.61,125.37 57.61,81.79
  Bottom 0.254: v57.61,13.44 55.63,11.45 X8.K | v57.61,348.97 55.63,350.95 X7.K
A8  (via drill 0.3)
  Top 0.254: 53.64,329.44 | 53.64,329.44 51.66,327.46 X6.L 51.66,325.48 53.64,323.49 53.64,279.91 51.66,277.93 X5.L 51.66,275.95 53.64,273.96 53.64,230.38 51.66,228.4 X4.L 51.66,226.42 53.64,224.43 53.64,180.85 51.66,178.87 X3.L 51.66,176.89 53.64,174.9 53.64,131.32 51.66,129.34 X2.L 51.66,127.36 53.64,125.37 53.64,81.79 | 53.64,81.79 | 53.64,81.79 51.66,79.81 X1.L 51.66,77.83 53.64,75.84 | 53.64,75.84 | 53.64,75.84 v53.64,13.44 | v53.64,348.97 53.64,329.44
  Bottom 0.254: v53.64,13.44 51.66,11.45 X8.L | 51.66,350.95 51.77,350.85 | 51.77,350.85 v53.64,348.97 | X7.L 51.77,353.06 51.77,350.85
A9  (via drill 0.3)
  Top 0.254: 49.68,329.44 | v49.68,13.44 49.68,75.84 47.7,77.83 X1.M 47.7,79.81 49.68,81.79 49.68,125.37 47.7,127.36 X2.M 47.7,129.34 49.68,131.32 49.68,174.9 47.7,176.89 X3.M 47.7,178.87 49.68,180.85 49.68,224.43 47.7,226.42 X4.M 47.7,228.4 49.68,230.38 49.68,273.96 47.7,275.95 X5.M 47.7,277.93 49.68,279.91 49.68,323.49 47.7,325.48 X6.M 47.7,327.46 49.68,329.44 | v49.68,348.97 49.68,329.44
  Bottom 0.254: v49.68,13.44 47.7,11.45 X8.M | 47.7,350.95 47.88,350.77 | 47.88,350.77 v49.68,348.97 | X7.M 47.88,353.06 47.88,350.77
A10  (via drill 0.3)
  Top 0.254: 45.72,329.44 | v45.72,13.44 45.72,75.84 43.74,77.83 X1.N 43.74,79.81 45.72,81.79 45.72,125.37 43.74,127.36 X2.N 43.74,129.34 | v45.72,348.97 45.72,329.44 | 45.72,329.44 43.74,327.46 X6.N 43.74,325.48 45.72,323.49 45.72,279.91 43.74,277.93 X5.N 43.74,275.95 45.72,273.96 45.72,230.38 43.74,228.4 X4.N 43.74,226.42 45.72,224.43 45.72,180.85 43.74,178.87 X3.N 43.74,176.89 45.72,174.9 45.72,131.32 43.74,129.34 | 45.72,131.32 43.74,129.34
  Bottom 0.254: v45.72,13.44 43.74,11.45 X8.N | v45.72,348.97 43.74,350.95 X7.N
A11  (via drill 0.3)
  Top 0.254: 41.76,329.44 | 41.76,329.44 39.78,327.46 X6.P 39.78,325.48 41.76,323.49 41.76,279.91 39.78,277.93 X5.P 39.78,275.95 41.76,273.96 41.76,230.38 39.78,228.4 X4.P 39.78,226.42 41.76,224.43 41.76,180.85 39.78,178.87 X3.P 39.78,176.89 41.76,174.9 41.76,131.32 39.78,129.34 X2.P 39.78,127.36 41.76,125.37 41.76,81.79 39.78,79.81 X1.P 39.78,77.83 41.76,75.84 v41.76,13.44 | v41.76,13.44 | v41.76,348.97 41.76,329.44
  Bottom 0.254: v41.76,13.44 39.78,11.45 X8.P | v41.76,348.97 39.78,350.95 X7.P
A12  (via drill 0.3)
  Top 0.254: 37.8,329.44 | 37.8,329.44 35.81,327.46 X6.R 35.81,325.48 37.8,323.49 37.8,279.91 35.81,277.93 X5.R 35.81,275.95 37.8,273.96 37.8,230.38 35.81,228.4 X4.R 35.81,226.42 37.8,224.43 37.8,180.85 35.81,178.87 X3.R 35.81,176.89 37.8,174.9 37.8,131.32 35.81,129.34 X2.R 35.81,127.36 37.8,125.37 37.8,81.79 35.81,79.81 X1.R 35.81,77.83 37.8,75.84 v37.8,13.44 | v37.8,348.97 37.8,329.44
  Bottom 0.254: v37.8,13.44 35.81,11.45 X8.R | v37.8,348.97 35.81,350.95 X7.R
A13  (via drill 0.3)
  Top 0.254: 33.83,329.44 | 33.83,75.84 31.85,77.83 X1.S 31.85,79.81 33.83,81.79 33.83,125.37 31.85,127.36 X2.S 31.85,129.34 33.83,131.32 33.83,174.9 31.85,176.89 X3.S 31.85,178.87 33.83,180.85 33.83,224.43 31.85,226.42 X4.S 31.85,228.4 33.83,230.38 33.83,273.96 31.85,275.95 X5.S 31.85,277.93 33.83,279.91 33.83,323.49 31.85,325.48 X6.S 31.85,327.46 33.83,329.44 | 33.83,75.84 | 33.83,75.84 v33.83,13.44 | v33.83,348.97 33.83,329.44
  Bottom 0.254: v33.83,348.97 31.85,350.95 X7.S | X8.S 31.85,11.45 v33.83,13.44
AUDIO
  Bottom 0.254: X8.Y 8.08,11.45 12.04,15.42 AUDIO.1
AUDIO'  (via drill 0.3)
  Top 0.254: v154.94,63.5 S2.4 154.94,74.29 153.67,75.56 153.67,120.65 154.94,121.92 S4.4 154.94,123.19 153.67,124.46 153.67,170.18 154.94,171.45 S6.4 154.94,172.72 153.67,173.99 153.67,219.71 154.94,220.98 S8.4 154.94,222.25 153.67,223.52 153.67,269.24 154.94,270.51 S10.4 154.94,271.78 153.67,273.05 153.67,318.13 154.94,319.4 S12.4
  Bottom 0.254: AUDIO.2 14.78,15.42 62.23,62.86 154.31,62.86 v154.94,63.5
AUDIO'_1
  Bottom 0.254: S2.5 153.67,81.91 153.67,86.36 145.73,94.3 22.57,94.3 | X1.Y 8.08,79.81 22.57,94.3 | 22.57,94.3 22.54,94.3
AUDIO'_2  (via drill 0.3)
  Top 0.254: S4.5 154.94,130.81 156.21,132.08 156.21,142.56 v154.94,143.83
  Bottom 0.254: X2.Y 8.08,129.34 22.57,143.83 v154.94,143.83
AUDIO'_3  (via drill 0.3)
  Top 0.254: S6.5 154.94,180.34 156.21,181.61 156.21,192.09 v154.94,193.36
  Bottom 0.254: X3.Y 8.08,178.87 22.57,193.36 v154.94,193.36
AUDIO'_4  (via drill 0.3)
  Top 0.254: S8.5 154.94,229.87 156.21,231.14 156.21,241.62 v154.94,242.89
  Bottom 0.254: X4.Y 8.08,228.4 22.57,242.89 v154.94,242.89
AUDIO'_5  (via drill 0.3)
  Top 0.254: S10.5 154.94,279.4 156.21,280.67 156.21,291.15 v154.94,292.42
  Bottom 0.254: X5.Y 8.08,277.93 22.57,292.42 v154.94,292.42
AUDIO'_6  (via drill 0.3)
  Top 0.254: 10.06,329.44 | v10.06,348.97 10.06,329.44 | 10.06,329.44 8.08,327.46 X6.Y | S12.5 154.94,328.93 156.21,330.2 156.21,340.68 v154.94,341.95
  Bottom 0.254: v10.06,348.97 8.08,350.95 X7.Y | X6.Y 8.08,327.46 22.57,341.95 v154.94,341.95
CR/!W
  Top 0.254: X8.18 X1.18 19.96,75.84 17.98,77.83 17.98,80.3 19.96,82.28 X2.18 19.96,125.37 17.98,127.36 17.98,129.34 19.96,131.32 X3.18 19.96,174.9 17.98,176.89 17.98,178.87 19.96,180.85 X4.18 19.96,224.43 17.98,226.42 17.98,228.4 19.96,230.38 X5.18 19.96,273.96 17.98,275.95 17.98,277.93 19.96,279.91 X6.18 19.96,323.49 17.98,325.48 17.98,327.46 19.96,329.44 X7.18
D0
  Top 0.254: X8.2 | 83.36,81.79 | 83.36,81.79 81.38,79.81 81.38,77.83 83.36,75.84 X1.2 X8.2 | 83.36,81.79 X2.2 83.36,125.37 81.38,127.36 81.38,129.34 83.36,131.32 X3.2 83.36,174.9 81.38,176.89 81.38,178.87 83.36,180.85 X4.2 83.36,224.43 81.38,226.42 81.38,228.4 83.36,230.38 X5.2 83.36,273.96 81.38,275.95 81.38,277.93 83.36,279.91 X6.2 83.36,323.49 81.38,325.48 81.38,327.46 83.36,329.44 X7.2
D1
  Top 0.254: X8.3 X1.3 79.4,75.84 77.42,77.83 77.42,79.81 79.4,81.79 | 79.4,81.79 | 79.4,81.79 X2.3 79.4,125.37 77.42,127.36 77.42,129.34 79.4,131.32 X3.3 79.4,174.9 77.42,176.89 77.42,178.87 79.4,180.85 X4.3 79.4,224.43 77.42,226.42 77.42,228.4 79.4,230.38 X5.3 79.4,273.96 77.42,275.95 77.42,277.93 79.4,279.91 X6.3 79.4,323.49 77.42,325.48 77.42,327.46 79.4,329.44 X7.3
D2
  Top 0.254: X6.4 | X8.4 | X6.4 75.44,323.49 73.46,325.48 73.46,327.46 75.44,329.44 X7.4 | 75.44,81.79 | 75.44,81.79 73.46,79.81 73.46,77.83 75.44,75.84 X1.4 X8.4 | 75.44,81.79 X2.4 75.44,125.37 73.46,127.36 73.46,129.34 75.44,131.32 X3.4 75.44,174.9 73.46,176.89 73.46,178.87 75.44,180.85 X4.4 75.44,224.43 73.46,226.42 73.46,228.4 75.44,230.38 X5.4 75.44,273.96 73.46,275.95 73.46,277.93 75.44,279.91 X6.4
D3
  Top 0.254: X8.5 | 71.48,81.79 | X8.5 X1.5 71.48,75.84 69.49,77.83 69.49,79.81 71.48,81.79 | 71.48,81.79 X2.5 71.48,125.37 69.49,127.36 69.49,129.34 71.48,131.32 X3.5 71.48,174.9 69.49,176.89 69.49,178.87 71.48,180.85 X4.5 71.48,224.43 69.49,226.42 69.49,228.4 71.48,230.38 X5.5 71.48,273.96 69.49,275.95 69.49,277.93 71.48,279.91 X6.5 71.48,323.49 69.49,325.48 69.49,327.46 71.48,329.44 X7.5
D4
  Top 0.254: X6.6 | X8.6 X1.6 67.51,75.84 65.53,77.83 65.53,79.81 67.51,81.79 | X6.6 67.51,323.49 65.53,325.48 65.53,327.46 67.51,329.44 X7.6 | 67.51,81.79 | 67.51,81.79 X2.6 67.51,125.37 65.53,127.36 65.53,129.34 67.51,131.32 X3.6 67.51,174.9 65.53,176.89 65.53,178.87 67.51,180.85 X4.6 67.51,224.43 65.53,226.42 65.53,228.4 67.51,230.38 X5.6 67.51,273.96 65.53,275.95 65.53,277.93 67.51,279.91 X6.6
D5
  Top 0.254: X8.7 | X8.7 X1.7 63.55,75.84 61.57,77.83 61.57,79.81 63.55,81.79 X2.7 63.55,125.37 61.57,127.36 61.57,129.34 63.55,131.32 X3.7 63.55,174.9 61.57,176.89 61.57,178.87 63.55,180.85 X4.7 63.55,224.43 61.57,226.42 61.57,228.4 63.55,230.38 X5.7 63.55,273.96 61.57,275.95 61.57,277.93 63.55,279.91 X6.7 63.55,323.49 61.57,325.48 61.57,327.46 63.55,329.44 X7.7
D6
  Top 0.254: X8.8 X1.8 59.59,75.84 57.61,77.83 57.61,79.81 59.59,81.79 | 59.59,81.79 | 59.59,81.79 X2.8 59.59,125.37 57.61,127.36 57.61,129.34 59.59,131.32 X3.8 59.59,174.9 57.61,176.89 57.61,178.87 59.59,180.85 X4.8 59.59,224.43 57.61,226.42 57.61,228.4 59.59,230.38 X5.8 59.59,273.96 57.61,275.95 57.61,277.93 59.59,279.91 X6.8 59.59,323.49 57.61,325.48 57.61,327.46 59.59,329.44 X7.8
D7
  Top 0.254: X8.9 | 55.63,81.79 | 55.63,81.79 53.64,79.81 53.64,77.83 55.63,75.84 X1.9 X8.9 | 55.63,81.79 X2.9 55.63,125.37 53.64,127.36 53.64,129.34 55.63,131.32 X3.9 55.63,174.9 53.64,176.89 53.64,178.87 55.63,180.85 X4.9 55.63,224.43 53.64,226.42 53.64,228.4 55.63,230.38 X5.9 55.63,273.96 53.64,275.95 53.64,277.93 55.63,279.91 X6.9 55.63,323.49 53.64,325.48 53.64,327.46 55.63,329.44 X7.9
FVCC  (via drill 1.3)
  Top 0.254: 119.38,320.68 119.38,332.11 RN11.1 | 119.38,84.45 RN1.1 | 119.38,133.98 RN3.1 | 119.38,183.51 RN5.1 | 119.38,233.05 RN7.1 | 119.38,282.57 RN9.1
  Top 1.93: S3.2 S3.1 119.38,122.55 | 119.38,122.55 119.38,84.45 119.38,73.02 | 119.38,73.02 v119.38,64.77 | 119.38,271.14 119.38,282.57 119.38,320.68 S11.1 S11.2 | 119.38,271.14 119.38,233.05 119.38,221.62 | 119.38,221.62 119.38,183.51 119.38,172.08 | 119.38,172.08 119.38,133.98 119.38,122.55 | S5.2 S5.1 119.38,172.08 | S7.2 S7.1 119.38,221.62 | S9.2 S9.1 119.38,271.14 | S1.1 S1.2 119.38,73.02
  Bottom 0.254: 144.78,132.02 127,132.02 RN3.1 | 144.78,132.02 | RN6.1 144.78,181.61 127,181.61 RN5.1 | RN8.1 144.78,231.14 127,231.14 RN7.1 | RN10.1 144.78,280.67 127,280.67 RN9.1 | RN4.1 144.78,132.02 | RN2.1 144.78,82.55 127,82.55 RN1.1 | RN11.1 127,330.2 144.78,330.2 RN12.1
  Bottom 1.93: v119.38,64.77 66.04,64.77 61.85,64.77 52.3,64.77 F1.P$2
GND  (via drill 0.3)
  Top 1.93: X8.Z 4.12,12.45 | X8.A 87.32,12.45
  Bottom 1.93: X8.Z 4.12,12.45 | X8.A 87.32,12.45
  other vias: 128.27,354.33 173.99,346.71 173.99,339.09 173.99,331.47 173.99,323.85 173.99,316.23 173.99,300.99 173.99,308.61 173.99,140.97 173.99,133.35 173.99,125.73 173.99,118.11 173.99,110.49 173.99,102.87 173.99,95.25 173.99,87.63 173.99,80.01 173.99,72.39 173.99,64.77 173.99,57.15 135.89,49.53 128.27,49.53 120.65,49.53 113.03,49.53 105.41,49.53 90.17,26.67 90.17,19.05 90.17,11.43 1.27,11.43 1.27,19.05 1.27,26.67 1.27,49.53 1.27,57.15 1.27,64.77 1.27,72.39 1.27,80.01 1.27,87.63 1.27,95.25 1.27,102.87 1.27,110.49 1.27,118.11 1.27,125.73 1.27,133.35 1.27,140.97 1.27,316.23 1.27,323.85 1.27,331.47 1.27,339.09 1.27,346.71 173.99,354.33 120.65,354.33 113.03,354.33 105.41,354.33 97.79,354.33 90.17,34.29 90.17,41.91 1.27,34.29 1.27,41.91 3.81,11.43 87.63,11.43 90.17,354.33 90.17,49.53 97.79,49.53 173.99,49.53 166.37,49.53 158.75,49.53 151.13,49.53 143.51,49.53 158.75,354.33 151.13,354.33 143.51,354.33 135.89,354.33 166.37,354.33 1.27,354.33 1.27,255.27 1.27,262.89 1.27,270.51 1.27,278.13 1.27,285.75 1.27,293.37 1.27,300.99 1.27,201.93 1.27,209.55 1.27,217.17 1.27,224.79 1.27,232.41 1.27,240.03 1.27,247.65 173.99,293.37 173.99,285.75 173.99,278.13 173.99,270.51 173.99,262.89 173.99,255.27 173.99,247.65 173.99,240.03 173.99,232.41 173.99,224.79 173.99,217.17 173.99,209.55 173.99,201.93 173.99,194.31 173.99,186.69 173.99,179.07 173.99,171.45 173.99,163.83 173.99,156.21 173.99,148.59 1.27,148.59 1.27,156.21 1.27,163.83 1.27,171.45 1.27,179.07 1.27,186.69 1.27,194.31
  pour Bottom (rank 2): 91.44,10.16 0,10.16 0,354.33 arc-90 1.27,355.6 173.99,355.6 arc-90 175.26,354.33 175.26,49.53 arc-90 173.99,48.26 92.71,48.26 arc90 91.44,46.99
  pour Top (rank 2): 0,10.16 0,354.33 arc-90 1.27,355.6 173.99,355.6 arc-90 175.26,354.33 175.26,49.53 arc-90 173.99,48.26 92.71,48.26 arc90 91.44,46.99 91.44,10.16
N$17
  Bottom 0.254: LED1.K R1.2
N$25
  Bottom 0.254: LED2.K R2.2
N$26
  Bottom 0.254: LED6.K R3.2
N$43
  Bottom 0.254: LED3.K R4.2
N$56
  Bottom 0.254: LED4.K R5.2
N$69
  Bottom 0.254: LED5.K R6.2
PHI2  (via drill 0.3)
  Top 0.254: 21.95,329.44 | 21.95,75.84 19.96,77.83 X1.V 19.96,79.81 21.95,81.79 21.95,125.37 19.96,127.36 X2.V 19.96,129.34 21.95,131.32 | 21.95,75.84 | 21.95,75.84 v21.95,13.44 | v21.95,348.97 21.95,329.44 | 21.95,329.44 19.96,327.46 X6.V 19.96,325.48 21.95,323.49 21.95,279.91 19.96,277.93 X5.V 19.96,275.95 21.95,273.96 21.95,230.38 19.96,228.4 X4.V 19.96,226.42 21.95,224.43 21.95,180.85 19.96,178.87 X3.V 19.96,176.89 21.95,174.9 21.95,131.32 | 21.95,131.32
  Bottom 0.254: v21.95,13.44 19.96,11.45 X8.V | v21.95,348.97 19.96,350.95 X7.V
VCC  (via drill 1.3)
  Top 1.93: X8.21 v8.08,14.6
  Bottom 1.93: v8.08,14.6 F1.P$1
VCC_1
  Bottom 0.254: S1.15 127,79.38 129.54,76.83 LED1.A
  Bottom 1.676: 8.08,69.21 8.08,57.78 C1.+
  Bottom 1.93: X1.21 8.08,69.21 8.08,68.58 112.39,68.58 S1.16 | S1.16 | S1.16 S1.15
VCC_2
  Bottom 0.254: S3.15 127,128.91 130.81,125.09 157.48,125.09 158.75,126.36 LED2.A
  Bottom 1.676: 8.08,121.28 8.08,108.58 C2.+
  Bottom 1.93: S3.15 S3.16 115.57,121.28 8.08,121.28 X2.21
VCC_3
  Bottom 0.254: S5.15 127,178.44 130.81,174.62 157.48,174.62 158.75,175.89 LED3.A
  Bottom 1.676: C3.+ 8.08,158.12 8.08,173.35
  Bottom 1.93: X3.21 8.08,173.35 8.08,170.81 115.57,170.81 S5.16 S5.15
VCC_4
  Bottom 0.254: S7.15 127,227.96 130.81,224.15 157.48,224.15 158.75,225.43 LED4.A
  Bottom 1.676: C4.+ 8.08,207.64 8.08,222.88
  Bottom 1.93: X4.21 8.08,222.88 8.08,220.34 115.57,220.34 S7.16 S7.15
VCC_5
  Bottom 0.254: S9.15 127,277.5 130.81,273.69 157.48,273.69 158.75,274.95 LED5.A
  Bottom 1.676: C5.+ 8.08,257.18 8.08,269.88
  Bottom 1.93: X5.21 8.08,269.88 115.57,269.88 S9.16 S9.15
VCC_6
  Bottom 0.254: LED6.A 158.75,324.49 157.48,323.21 131.44,323.21 127,327.66 S11.15
  Bottom 1.676: 8.08,319.4 8.08,306.7 C6.+
  Bottom 1.93: X6.21 8.08,319.4 115.57,319.4 S11.16 | S11.16 | S11.16 S11.15
  pour Bottom (no thermals): 7.09,322.5 9.07,322.5 arc90 8.08,323.49 arc90
  pour Top (no thermals): 7.09,354.99 9.07,354.99 9.07,329.44 7.09,327.46 7.09,325.48 9.07,323.49 9.07,322.5 arc-90 8.08,321.51 arc-90 7.09,322.5 7.09,323.49 5.11,325.48 5.11,327.46 7.09,329.44
VR/!W
  Top 0.254: X8.17 X1.17 23.93,75.84 21.95,77.83 21.95,79.81 23.93,81.79 X2.17 23.93,125.37 21.95,127.36 21.95,129.34 23.93,131.32 X3.17 23.93,174.9 21.95,176.89 21.95,178.87 23.93,180.85 X4.17 23.93,224.43 21.95,226.42 21.95,228.4 23.93,230.38 X5.17 23.93,273.96 21.95,275.95 21.95,277.93 23.93,279.91 X6.17 23.93,323.49 21.95,325.48 21.95,327.46 23.93,329.44 X7.17

## Text on the board
tValues: NORM | SWAP | NORM | IO2/IO3 | POWER | POWER | IO2 | IO3 | BLK1 | BLK2 | BLK3 | BLK5 | RAM1 | RAM2 | RAM3 | AUDIO | SWAP | NORM | SWAP | NORM | IO2/IO3 | POWER | POWER | IO2 | IO3 | BLK1 | BLK2 | BLK3 | BLK5 | RAM1 | RAM2 | RAM3 | AUDIO | SWAP | NORM | SWAP | NORM | IO2/IO3 | POWER | POWER | IO2 | IO3 | BLK1 | BLK2 | BLK3 | BLK5 | RAM1 | RAM2 | RAM3 | AUDIO | SWAP | NORM | SWAP | NORM | IO2/IO3 | POWER | POWER | IO2 | IO3 | BLK1 | BLK2 | BLK3 | BLK5 | RAM1 | RAM2 | RAM3 | AUDIO | SWAP | NORM | SWAP | NORM | IO2/IO3 | NORM | POWER | POWER | IO2 | IO3 | BLK1 | BLK2 | BLK3 | BLK5 | RAM1 | RAM2 | RAM3 | AUDIO | SWAP | POWER | POWER | IO2 | IO3 | BLK1 | BLK2 | BLK3 | BLK5 | RAM1 | RAM2 | RAM3 | AUDIO